# Altium schematic sheet Sht4-Interfaces.SchDoc
size C; SheetNumber: 4; SheetTotal: 4
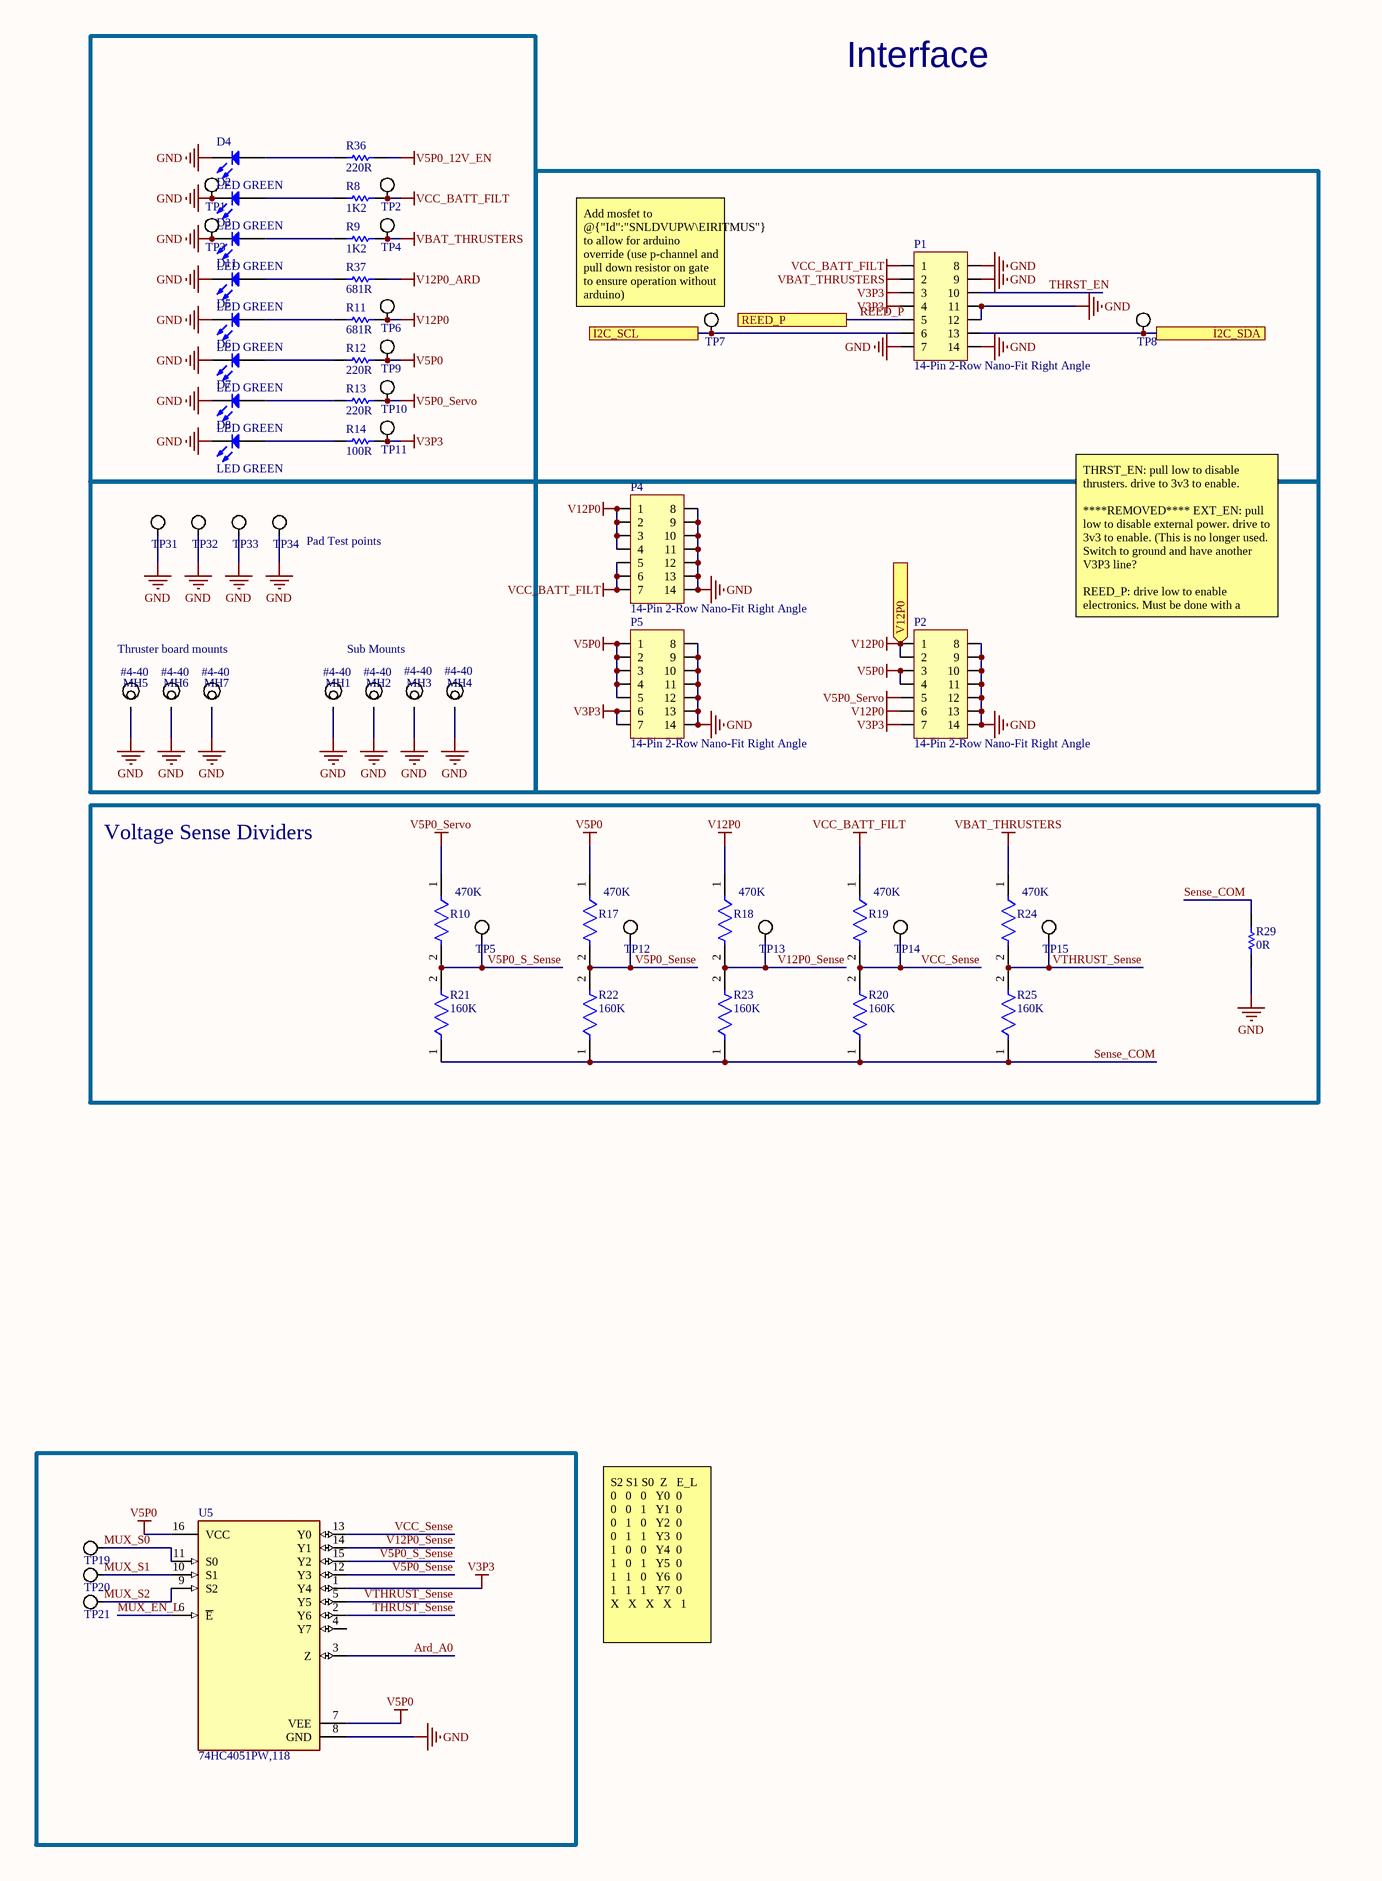
[diagram p0: Sht4-Interfaces.SchDoc, left]
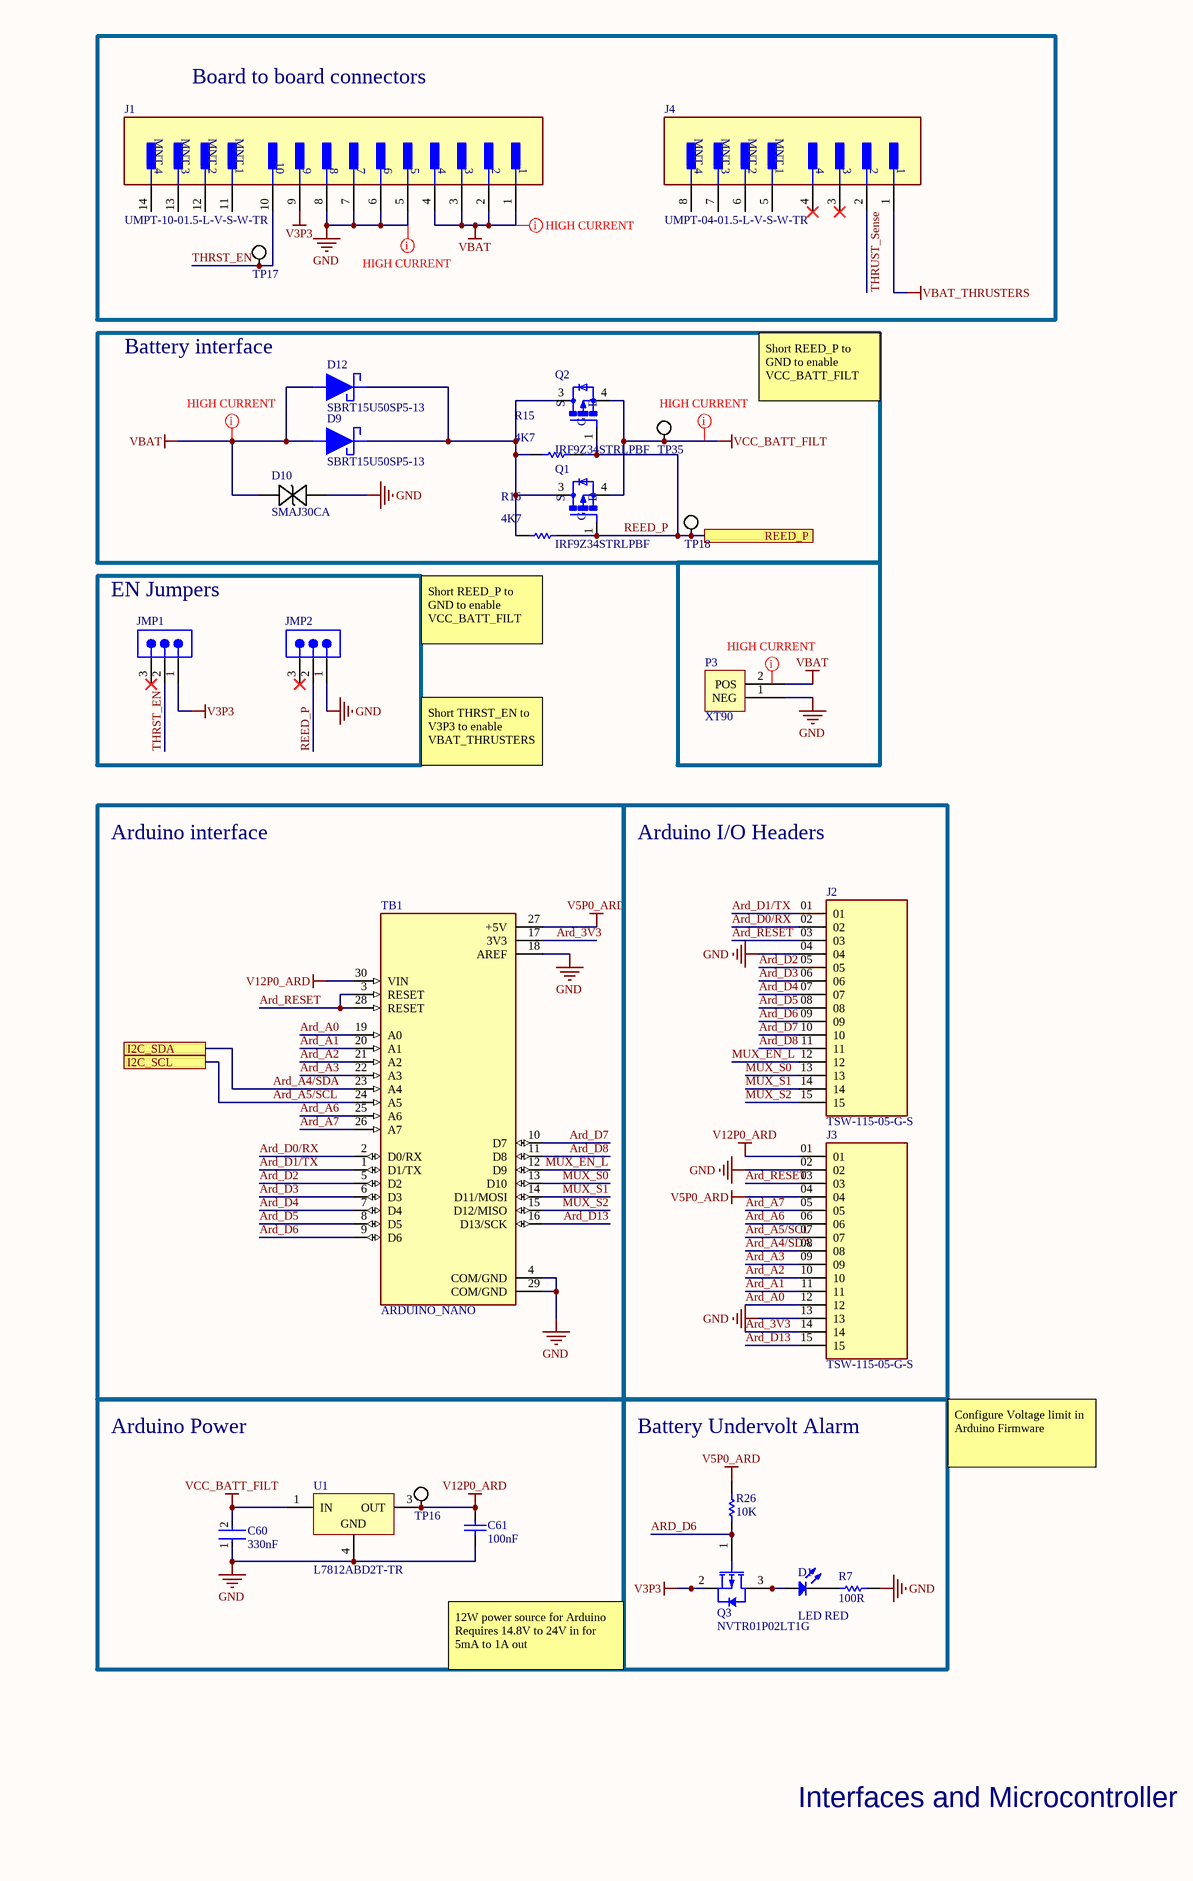
[diagram p1: Sht4-Interfaces.SchDoc, right]

## Parts
C60  330nF  [FP-C1608-080-0_1-IPC_A]
C61  100nF  [CAPC0603(1608)100_L]
D1  LED RED  [C0805]
D2  LED GREEN  [LED_0805]
D3  LED GREEN  [LED_0805]
D4  LED GREEN  [LED_0805]
D5  LED GREEN  [LED_0805]
D6  LED GREEN  [LED_0805]
D7  LED GREEN  [LED_0805]
D8  LED GREEN  [LED_0805]
D9  SBRT15U50SP5-13  [SBRT15U50SP5-13]
D10  SMAJ30CA  [SMASeries_LTF]
D11  LED GREEN  [LED_0805]
D12  SBRT15U50SP5-13  [SBRT15U50SP5-13]
J1  UMPT-10-01.5-L-V-S-W-TR  [FP-UMPT-10-01_5-L-V-S-W-T-MFG]
J2  TSW-115-05-G-S  [SAMTEC_TSW-115-05-G-S]
J3  TSW-115-05-G-S  [SAMTEC_TSW-115-05-G-S]
J4  UMPT-04-01.5-L-V-S-W-TR  [FP-UMPT-04-01_5-L-V-S-W-T-MFG]
JMP1  TSW-103-07-L-S  [SMTC-TSW-103-07-X-S]  (value not drawn)
JMP2  TSW-103-07-L-S  [SMTC-TSW-103-07-X-S]  (value not drawn)
MH1  #4-40  [Mounting Hole #4-40]
MH2  #4-40  [Mounting Hole #4-40]
MH3  #4-40  [Mounting Hole #4-40]
MH4  #4-40  [Mounting Hole #4-40]
MH5  #4-40  [Mounting Hole #4-40]
MH6  #4-40  [Mounting Hole #4-40]
MH7  #4-40  [Mounting Hole #4-40]
P1  14-Pin 2-Row Nano-Fit Right Angle  [MOLEX NANO-FIT 2X7 - Right Angle]
P2  14-Pin 2-Row Nano-Fit Right Angle  [MOLEX NANO-FIT 2X7 - Right Angle]
P3  XT90  [XT90]
P4  14-Pin 2-Row Nano-Fit Right Angle  [MOLEX NANO-FIT 2X7 - Right Angle]
P5  14-Pin 2-Row Nano-Fit Right Angle  [MOLEX NANO-FIT 2X7 - Right Angle]
Q1  IRF9Z34STRLPBF  [TO254P1521X483-4N]
Q2  IRF9Z34STRLPBF  [TO254P1521X483-4N]
Q3  NVTR01P02LT1G  [ONSC-SOT-23-3-318-08_V]
R7  100R  [RESC1609X50X30NL10T20]
R8  1K2  [RESC0603(1608)_L]
R9  1K2  [RESC0603(1608)_L]
R10  470K  [FP-CRCW0805-e3-IPC_C]
R11  681R  [RESC0603(1608)_L]
R12  220R  [RESC0603(1608)_L]
R13  220R  [RESC0603(1608)_L]
R14  100R  [RESC0603(1608)_L]
R15  4K7  [RESC0603(1608)_L]
R16  4K7  [RESC0603(1608)_L]
R17  470K  [FP-CRCW0805-e3-IPC_C]
R18  470K  [FP-CRCW0805-e3-IPC_C]
R19  470K  [FP-CRCW0805-e3-IPC_C]
R20  160K  [FP-CRCW0805-e3-IPC_C]
R21  160K  [FP-CRCW0805-e3-IPC_C]
R22  160K  [FP-CRCW0805-e3-IPC_C]
R23  160K  [FP-CRCW0805-e3-IPC_C]
R24  470K  [FP-CRCW0805-e3-IPC_C]
R25  160K  [FP-CRCW0805-e3-IPC_C]
R26  10K  [RESC1609X50X30NL8T20]
R29  0R  [RESC2013X50X30LL20T20]
R36  220R  [RESC0603(1608)_L]
R37  681R  [RESC0603(1608)_L]
TB1  ARDUINO_NANO  [SHIELD_ARDUINO_NANO]
TP1  Test Point Loop  [Test Point Loop - Black]  (value not drawn)
TP2  Test Point Loop  [Test Point Loop - Black]  (value not drawn)
TP3  Test Point Loop  [Test Point Loop - Black]  (value not drawn)
TP4  Test Point Loop  [Test Point Loop - Black]  (value not drawn)
TP5  (no value)  [Test Point Pad]
TP6  Test Point Loop  [Test Point Loop - Black]  (value not drawn)
TP7  Test Point Loop  [Test Point Loop - Black]  (value not drawn)
TP8  Test Point Loop  [Test Point Loop - Black]  (value not drawn)
TP9  Test Point Loop  [Test Point Loop - Black]  (value not drawn)
TP10  Test Point Loop  [Test Point Loop - Black]  (value not drawn)
TP11  Test Point Loop  [Test Point Loop - Black]  (value not drawn)
TP12  (no value)  [Test Point Pad]
TP13  (no value)  [Test Point Pad]
TP14  (no value)  [Test Point Pad]
TP15  (no value)  [Test Point Pad]
TP16  (no value)  [Test Point Pad]
TP17  (no value)  [Test Point Pad]
TP18  (no value)  [Test Point Pad]
TP19  (no value)  [Test Point Pad]
TP20  (no value)  [Test Point Pad]
TP21  (no value)  [Test Point Pad]
TP31  (no value)  [Test Point Pad]
TP32  (no value)  [Test Point Pad]
TP33  (no value)  [Test Point Pad]
TP34  (no value)  [Test Point Pad]
TP35  (no value)  [Test Point Pad]
U1  L7812ABD2T-TR  [TO-263_L]
U5  74HC4051PW,118  [FP-SOT403-1-IPC_A]

## Blocks framed on the sheet
Board to board connectors: J1 J4 TP17
Battery interface: D9 D10 D12 Q1 Q2 R15 R16 TP18 TP35
EN Jumpers: JMP1 JMP2
Voltage Sense Dividers: R10 R17-R25 R29 TP5 TP12-TP15
Arduino interface: TB1
Arduino I/O Headers: J2 J3
Arduino Power: C60 C61 TP16 U1
Battery Undervolt Alarm: D1 Q3 R7 R26

## Ports
I2C_SCL, I2C_SDA, REED_P, V12P0 (in, see Sht1-BlockDiagram[2B], Sht3-V12P0_reg[4B], Sht3-V12P0_reg[4C])

## Nets
GND: C60.1 C61.2 D2.1(K) D3.1(K) D4.1(K) D5.1(K) D6.1(K) D7.1(K) D8.1(K) D10.1 D11.1(K) J1.5 J1.6 J1.7 J1.8 J2.04 J3.02 J3.13 JMP2.1 MH1.0 MH2.0 MH3.0 MH4.0 MH5.0 MH6.0 MH7.0 P1.7 P1.8 P1.9 P1.11 P1.12 P1.14 P2.8 P2.9 P2.10 P2.11 P2.12 P2.13 P2.14 P3.1(NEG) P4.8 P4.9 P4.10 P4.11 P4.12 P4.13 P4.14 P5.8 P5.9 P5.10 P5.11 P5.12 P5.13 P5.14 R7.2 R29.2 TB1.4(COM/GND) TB1.18(AREF) TB1.29(COM/GND) TP1.1 TP3.1 TP31.1 TP32.1 TP33.1 TP34.1 U1.4(GND) U5.8(GND)
V3P3: J1.9 JMP1.1 P1.3 P1.4 P2.7 P5.6 P5.7 Q3.2(S) R14.2 TP11.1 U5.1(Y4)
V5P0: P2.3 P2.4 P5.1 P5.2 P5.3 P5.4 P5.5 R12.2 R17.1 TP9.1 U5.7(VEE) U5.16(VCC)
V5P0_12V_EN: R36.2
V5P0_ARD: J3.04 R26.2 TB1.27(+5V)
V5P0_Servo: P2.5 R10.1 R13.2 TP10.1
V12P0: P2.1 P2.2 P2.6 P4.1 P4.2 P4.3 P4.4 R11.2 R18.1 TP6.1 ; port V12P0
V12P0_ARD: C61.1 J3.01 R37.2 TB1.30(VIN) TP16.1 U1.3(OUT)
VBAT: D9.1 D10.2 D12.1 J1.1 J1.2 J1.3 J1.4 P3.2(POS)
VBAT_THRUSTERS: J4.1 P1.2 R9.2 R24.1 TP4.1
VCC_BATT_FILT: C60.2 P1.1 P4.5 P4.6 P4.7 Q1.4(D) Q2.4(D) R8.2 R19.1 TP2.1 TP35.1 U1.1(IN)
Ard_3V3: J3.14 TB1.17(3V3)
Ard_A0: J3.12 TB1.19(A0) U5.3(Z)
Ard_A1: J3.11 TB1.20(A1)
Ard_A2: J3.10 TB1.21(A2)
Ard_A3: J3.09 TB1.22(A3)
Ard_A4/SDA: J3.08 P1.13 TB1.23(A4) TP8.1 ; port I2C_SDA
Ard_A5/SCL: J3.07 P1.6 TB1.24(A5) TP7.1 ; port I2C_SCL
Ard_A6: J3.06 TB1.25(A6)
Ard_A7: J3.05 TB1.26(A7)
Ard_D0/RX: J2.02 TB1.2(D0/RX)
Ard_D1/TX: J2.01 TB1.1(D1/TX)
Ard_D2: J2.05 TB1.5(D2)
Ard_D3: J2.06 TB1.6(D3)
Ard_D4: J2.07 TB1.7(D4)
Ard_D5: J2.08 TB1.8(D5)
Ard_D6: J2.09 Q3.1(G) R26.1 TB1.9(D6)
Ard_D7: J2.10 TB1.10(D7)
Ard_D8: J2.11 TB1.11(D8)
Ard_D13: J3.15 TB1.16(D13/SCK)
Ard_RESET: J2.03 J3.03 TB1.3(RESET) TB1.28(RESET)
MUX_EN_L: J2.12 TB1.12(D9) U5.6(~{E})
MUX_S0: J2.13 TB1.13(D10) TP19.1 U5.11(S0)
MUX_S1: J2.14 TB1.14(D11/MOSI) TP20.1 U5.10(S1)
MUX_S2: J2.15 TB1.15(D12/MISO) TP21.1 U5.9(S2)
REED_P: JMP2.2 P1.5 Q1.1(G) Q2.1(G) R15.2 R16.2 TP18.1 ; port REED_P
Sense_COM: R20.1 R21.1 R22.1 R23.1 R25.1 R29.1
THRST_EN: J1.10 JMP1.2 P1.10 TP17.1
THRUST_Sense: J4.2 U5.2(Y6)
V5P0_S_Sense: R10.2 R21.2 TP5.1 U5.15(Y2)
V5P0_Sense: R17.2 R22.2 TP12.1 U5.12(Y3)
V12P0_Sense: R18.2 R23.2 TP13.1 U5.14(Y1)
VCC_Sense: R19.2 R20.2 TP14.1 U5.13(Y0)
VTHRUST_Sense: R24.2 R25.2 TP15.1 U5.5(Y5)
NetD1_1: D1.1(K) R7.1
NetD1_2: D1.2(A) Q3.3(D)
NetD2_2: D2.2(A) R8.1
NetD3_2: D3.2(A) R9.1
NetD4_2: D4.2(A) R36.1
NetD5_2: D5.2(A) R11.1
NetD6_2: D6.2(A) R12.1
NetD7_2: D7.2(A) R13.1
NetD8_2: D8.2(A) R14.1
NetD9_2: D9.2 D12.2 Q1.3(S) Q2.3(S) R15.1 R16.1
NetD11_2: D11.2(A) R37.1

Not connected (* = marked no-connect by the designer): J1 11(MNT_1) 12(MNT_2) 13(MNT_3) 14(MNT_4); J4 3* 4* 5(MNT_1) 6(MNT_2) 7(MNT_3) 8(MNT_4); JMP1 3*; JMP2 3*; U5 4(Y7)

## Layout directives
mark named HIGH CURRENT: (no net found under the mark), GND, VBAT, VCC_BATT_FILT

## Notes on the sheet
- Interface
- (near TP7) Add mosfet to @{"Id":"SNLDVUPW\EIRITMUS"} to allow for arduino override (use p-channel and pull down resistor on gate to ensure operation without arduino)
- Short REED_P to GND to enable VCC_BATT_FILT
- (near TP34) Pad Test points
- Thruster board mounts
- Sub Mounts
- THRST_EN: pull low to disable thrusters. drive to 3v3 to enable.
  ****REMOVED**** EXT_EN: pull low to disable external power. drive to 3v3 to enable. (This is no longer used. Switch to ground and have another V3P3 line?
  REED_P: drive low to enable electronics. Must be done with a hardware switch.
- Short THRST_EN to V3P3 to enable VBAT_THRUSTERS
- Configure Voltage limit in Arduino Firmware
- S2 S1 S0  Z   E_L
  0   0   0   Y0  0
  0   0   1   Y1  0
  0   1   0   Y2  0
  0   1   1   Y3  0
  1   0   0   Y4  0
  1   0   1   Y5  0
  1   1   0   Y6  0
  1   1   1   Y7  0
  X   X   X   X   1
- 12W power source for Arduino
  Requires 14.8V to 24V in for 5mA to 1A out
- Interfaces and Microcontroller

## Library data of the parts
C60 = 330nF 0603: Multilayer Ceramic Capacitors 330nF ±10% 50V X7R SMD 0603; Capacitance: 330nF; Case Code (Imperial): 0603; Case Code (Metric): 1608; Dielectric: X7R; Length: 1.6mm; Construction: Flat; Resistor Type: Ceramic; Mount: Surface Mount; Voltage Rating: 50V; Packaging: Tape and Reel; Series: C; Case/Package: 0603; Lead Free: Lead Free; Tolerance: 10%; Voltage: 50V; REACH SVHC: No SVHC; Height: 0.8mm; Weight: 7.1E-05oz; Termination: SMD/SMT; Max Operating Temperature: 125°C; RoHS Compliant: Yes; Min Operating Temperature: -55°C; Depth: 0.8mm; Package Quantity: 1; Thickness: 0.037inch; Voltage Rating (DC): 50V; Dielectric Material: Ceramic; Width: 0.031inch; ComponentLink1Description: Link; ComponentLink1URL: https://www.digikey.com/en/products/detail/tdk-corporation/C1608X7R1H334K080AC/2443428
C61 = 100nF 0603: CAP 100nF 100V ±10% 0603 (1608 Metric) Thickness 1mm SMD; Tolerance: Â±10%; Case-EIA: 0603; Case-Metric: 1608; Rated Voltage: 100 V; Value: 100nF; Technology: SMT; Max Thickness: 1 mm; ComponentLink1Description: Link; ComponentLink1URL: https://www.digikey.com/en/products/detail/samsung-electro-mechanics/CL10B104KC8NNNC/5961291
D1 = Red LED 0805: led / LTST-C171KRKT; Manufacturer: Lite-On Inc.; Lens Color: Colorless; Lens Transparency: Clear; Millicandela Rating: 54mcd; Lens Style/Size: Rectangle with Flat Top, 1.40mm x 1.25mm; Voltage - Forward (Vf) (Typ): 2V; Current - Test: 20mA; Viewing Angle: 130°; Wavelength - Dominant: 631nm; Wavelength - Peak: 639nm; Supplier 1: Digi-Key; Supplier Part Number 1: 160-1427-1-ND; Manufacturer Part Number: LTST-C171KRKT; RoHS: RoHS Compliant; Category: Optoelectronics; Stock 1: 260544; Pricing 1: 1=0.31, 10=0.225, 25=0.1656, 100=0.1183, 250=0.0804, 500=0.07096, 1000=0.05558 (USD); Packaging: Cut Tape (CT); Part Status: Active; Color: Red; Mounting Type: Surface Mount; Features: -; Package / Case: 0805 (2012 Metric); Size / Dimension: 2.00mm L x 1.25mm W; Height (Max): 0.80mm; ComponentLink1URL: http://optoelectronics.liteon.com/upload/download/DS22-2000-109/LTST-C171KRKT.pdf; ComponentLink1Description: http://optoelectronics.liteon.com/upload/download/DS22-2000-109/LTST-C171KRKT.pdf; ComponentLink2Description: Link; ComponentLink2URL: https://www.digikey.com/en/products/detail/liteon/LTST-C171KRKT/386801
D2-D8 D11 = Green LED 0805: led; Manufacturer: Lite-On Inc.; Manufacturer Part Number: LTST-C171KGKT; Lens Color: Colorless; Lens Transparency: Clear; Millicandela Rating: 35mcd; Lens Style/Size: Rectangle with Flat Top, 1.40mm x 1.25mm; Voltage - Forward (Vf) (Typ): 2V; Current - Test: 20mA; Viewing Angle: 130°; Wavelength - Dominant: 571nm; Wavelength - Peak: 574nm; Supplier 1: Digi-Key; Supplier Part Number 1: 160-1426-1-ND; RoHS: RoHS Compliant; Category: Optoelectronics; Stock 1: 350441; Pricing 1: 1=0.31, 10=0.225, 25=0.1656, 100=0.1183, 250=0.0804, 500=0.07096, 1000=0.05558 (USD); Packaging: Cut Tape (CT); Part Status: Active; Color: Green; Mounting Type: Surface Mount; Features: -; Package / Case: 0805 (2012 Metric); Size / Dimension: 2.00mm L x 1.25mm W; Height (Max): 0.90mm; ComponentLink1URL: http://optoelectronics.liteon.com/upload/download/DS22-2000-118/LTST-C171KGKT.pdf; ComponentLink1Description: http://optoelectronics.liteon.com/upload/download/DS22-2000-118/LTST-C171KGKT.pdf; ComponentLink2Description: Link; ComponentLink2URL: https://www.digikey.com/en/products/detail/LTST-C171KGKT/160-1426-1-ND/386798?curr=usd&utm_campaign=buynow&utm_medium=aggregator&utm_source=octopart
D10 = SMAJ30CA: No Description Available; Mfr_Name: Littelfuse Inc; Digi-Key_Part_Number_8: SMAJ30CALFTR-ND; Digi-Key_Part_Number_7: SMAJ30CALFDKR-ND; Digi-Key_Part_Number_1: 2516-SMAJ30CATR-ND; Digi-Key_Part_Number_2: 2997-SMAJ30CATR-ND; Digi-Key_Part_Number_3: SMAJ30CABCT-ND; Digi-Key_Part_Number_4: SMAJ30CABDKR-ND; Digi-Key_Part_Number_5: SMAJ30CABTR-ND; Digi-Key_Part_Number_6: SMAJ30CALFCT-ND
J1 = UMPT-10-1.5: CONN MPOWER 2MM MALE 10POS GOLD; System: Connector; ComponentLink1Description: Link; ComponentLink1URL: https://www.digikey.com/en/products/detail/samtec-inc/UMPT-10-01-5-L-V-S-W-TR/14670365?s=N4IgTCBcDaIKoFkAKAVAtARgAxqxgdAKxoAyaAamgMpoDqaKASiALoC%2BQA
J2 J3 = TSW-115-05-G-S: MF: Samtec; Value: *; Availability: Unavailable; Price: None; MP: TSW-115-05-G-S; Package: None
J4 = UMPT-04-1.5: CONN MPOWER 2MM MALE 4POS GOLD; ComponentLink1Description: Link; ComponentLink1URL: https://www.digikey.com/en/products/detail/samtec-inc/UMPT-04-01-5-L-V-S-W-TR/14670336?s=N4IgTCBcDaIKoFkAKAVAtABgCyYIwDoBWNAGTQDU0BlNAdTRQCUQBdAXyA
JMP1 JMP2 = 3 Pos .1" connector/jumper: 0.025" SQ Post Header, Through-hole, Vertical, -55 to 125 degC, 2.54 mm Pitch, 3-Pin, Male, RoHS; Manufacturer: Samtec; Pitch: 2.54 mm; Mounting Technology: Through-hole; ComponentLink2URL: http://www.samtec.com/documents/webfiles/pdf/TSW_TH.PDF; ComponentLink3Description: Package Specification; PackageVersion: DM, 8/1988; PartNumber: TSW-103-07-L-S; PackageReference: TSW-103-07-X-S; Orientation: Vertical; ComponentLink1URL: http://www.samtec.com; PackageDescription: .025[0.64] SQ. Post Terminal Strip Assembly; ComponentLink1Description: Manufacturer URL; ComponentLink2Description: Datasheet; ComponentLink3URL: http://www.samtec.com/documents/webfiles/cpdf/TSW-XXX-XX-XXX-X-XX-XXX-MKT.pdf; RoHS: True; DatasheetVersion: F-214; Temperature Range: -55 to 125 degC
MH1-MH7 = Mounting Hole #4-40, Loose Fit: Mounting Hole for ANSI #4-40 w/ Flat Washer, Loose Fit; Datasheet: http://blogs.mentor.com/tom-hausherr/blog/tag/pcb-mounting-holes/
P1 P2 P4 P5 = 14-Pin 2-Row Nano-Fit Right Angle: NanoFit Right Hdr TH DR 14Ckt; Part Number: 105314-1214; Manufacturer: Molex; Supplier: Mouser; Supplier Part Number: 538-105314-1214; Supplier 1: Mouser; Supplier Part Number 1: 538-105314-1214; ComponentLink1Description: Mouser Link; ComponentLink1URL: https://www.mouser.com/ProductDetail/Molex/105314-1214?qs=PqFvFmEiOr6wLIXpvlvqbA%3D%3D; ComponentLink2Description: Link; ComponentLink2URL: https://www.digikey.com/en/products/detail/molex/1053141114/7693193
Q1 Q2 = IRF9Z34STRLPBF: P-Channel 60V 18A _Tc_ 3.7W _Ta_, 88W _Tc_ Surface Mount D2PAK; MF: Vishay; Package: D2PAK Vishay; Value: *; Availability: Unavailable; MP: IRF9Z34STRLPBF; Price: None; SnapEDA_Link: https://www.snapeda.com/parts/IRF9Z34STRLPBF/Vishay%20Siliconix/view-part/813693/?ref=snap
Q3 = PMOS SOT-23: Power MOSFET, -20 V, -1.3 A, P-Channel, 3-Pin SOT-23, Pb-Free, Tape and Reel; Manufacturer: On Semiconductor; Ciss Typ (pF): 225; Configuration: Single; Coss Typ (pF): 130; PD Max (W): 0.4; ID Max (A): 1.3; Crss Typ (pF): 55; VGS Max (V): 12; V(BR)DSS Min (V): 20; VGS(th) Max (V): 1.25; Qrr Typ (nC): 8.5; Channel Polarity: P Channel; ComponentLink1URL: http://www.onsemi.com/; PackageReference: SOT-23-3-318-08; RoHS: Pb-Free; ComponentLink1Description: Manufacturer URL; PackageDescription: 3-Pin Small Outline Transistor, Body 2.92 x 1.3 mm, Pitch 0.95 mm; ComponentLink3Description: Package Specification; ComponentLink2Description: Datasheet; Package Type: SOT-23-3; ComponentLink2URL: http://www.onsemi.cn/pub_link/Collateral/NTR1P02LT1-D.PDF; Packing: Tape and Reel; Mounting Technology: Surface Mount; ComponentLink3URL: http://www.onsemi.cn/pub_link/Collateral/318-08.PDF; PartNumber: NVTR01P02LT1G; PackageVersion: Rev. AP, 11/2009; DatasheetVersion: Rev. 13; ComponentLink4Description: Link; ComponentLink4URL: https://www.digikey.com/en/products/detail/vishay-siliconix/IRF9Z34STRLPBF/856689?s=N4IgTCBcDaIJICUBiBOAWgZgCwGUAqCAMgAoBCSIAugL5A
R7 = 100R 0603: 100R 0.1W 5%; Part Number: CRCW0603100RJNTA; Manufacturer: Vishay Dale; ComponentLink1Description: Link; ComponentLink1URL: https://www.digikey.com/en/products/detail/yageo/RC0603FR-13100RL/12756392
R8 R9 = CMP-1012-00518-1: 1K2 0.1W 1% 0603 (1608 Metric)  SMD; Case-EIA: 0603; Value: 1200.00 Ohm; Case-Metric: 1608; Power: 0.1 W; Technology: SMT; Tolerance: 1 %
R10 R17-R19 R24 = 470K 0805: RES Thick Film, 470kΩ, 1%, 0.125W, 100ppm/°C, 0805; Power Rating: 125mW; Voltage Rating (DC): 150V; Depth: 1.25mm; Voltage Rating: 150V; Composition: Thick Film; Temperature Coefficient: 100ppm/°C; Max Operating Temperature: 155°C; Min Operating Temperature: -55°C; Package Quantity: 10; Width: 0.049inch; Number of Pins: 2; Length: 2mm; Case Code (Metric): 2012; Weight: 0.000194oz; Features: Automotive AEC-Q200; Number of Terminations: 2; Radiation Hardening: No; Height: 0.45mm; Military Standard: Not; Tolerance: 1%; Lead Free: Lead Free; Termination: SMD/SMT; Case Code (Imperial): 0805; Case/Package: 0805; Contact Plating: Tin; Packaging: Tape and Reel; Max Power Dissipation: 125mW; ComponentLink1Description: Link; ComponentLink1URL: https://www.digikey.com/en/products/detail/yageo/RC0805FR-07470KL/727977
R11 R37 = CMP-1012-00492-1: 681R 0.1W 1% 0603 (1608 Metric)  SMD; Value: 681.00 Ohm; Case-Metric: 1608; Case-EIA: 0603; Technology: SMT; Tolerance: 1 %; Power: 0.1 W
R12 R13 R36 = CMP-1012-00058-1: 220R 0.1W 5% 0603 (1608 Metric)  SMD; Case-EIA: 0603; Case-Metric: 1608; Value: 220.00 Ohm; Technology: SMT; Power: 0.1 W; Tolerance: 5 %
R14 = CMP-1012-00050-1: 100R 0.1W 5% 0603 (1608 Metric)  SMD; Case-EIA: 0603; Value: 100.00 Ohm; Case-Metric: 1608; Tolerance: 5 %; Technology: SMT; Power: 0.1 W
R15 R16 = 4K7 0603: 4K7 0.1W 1% 0603 (1608 Metric)  SMD; Case-EIA: 0603; Case-Metric: 1608; Value: 4700.00 Ohm; Power: 0.1 W; Tolerance: 1 %; Technology: SMT; ComponentLink1Description: Link; ComponentLink1URL: https://www.digikey.com/en/products/detail/yageo/RC0603FR-074K7L/727212
R20-R23 R25 = 160K 0805: RES Thick Film, 160kΩ, 1%, 0.125W, 100ppm/°C, 0805; Voltage Rating: 150V; Power Rating: 125mW; Width: 1.25mm; Case/Package: 0805; Package Quantity: 5000; Temperature Coefficient: 100ppm/°C; Length: 2mm; Height: 0.45mm; Weight: 0.000194oz; Mount: Surface Mount; Case Code (Metric): 2012; Min Operating Temperature: -55°C; Termination: SMD/SMT; Case Code (Imperial): 0805; Number of Pins: 2; Packaging: Tape and Reel; Max Operating Temperature: 155°C; Radiation Hardening: No; Military Standard: Not; Depth: 1.25mm; Tolerance: 1%; Composition: Thick Film; Contact Plating: Tin; ComponentLink1Description: Link; ComponentLink1URL: https://www.digikey.com/en/products/detail/yageo/RC0805FR-07160KL/727628
R26 = 10K 0603: Chip Resistor, 10 KOhm, +/- 1%, 100 mW, -55 to 155 degC, 0603 (1608 Metric), RoHS, Tape and Reel; Manufacturer: Vishay Semiconductor; Voltage Rating: 75 V; Max Operating Temperature: 155 degC; PackageDescription: 2-Pin Surface Mount Device, Body 1.575 x 0.85 mm; ComponentLink1Description: Manufacturer URL; RoHSCompliant: true; PackageReference: 0603; REACH SVHC: Unknown; Length: 1.55 mm; DatasheetVersion: 06/2012; Packaging: Tape and Reel; Min Operating Temperature: -55 degC; Mounting Technology: Surface Mount; ComponentLink2URL: https://datasheet.ciiva.com/11809/0900766b80d98afc-11809037.pdf; Height: 0.45 mm; ComponentLink2Description: Datasheet; Package Quantity: 5000; ComponentLink1URL: http://www.vishay.com/; ComponentLink3Description: Link; ComponentLink3URL: https://www.digikey.com/en/products/detail/stackpole-electronics-inc/RNCP0603FTD10K0/2240139
R29 = 0R 0805: 0 Ohm 0805; Manufacturer: Vishay Dale; Part Number: CRCW08050000Z0EA; ComponentLink1Description: Link; ComponentLink1URL: https://www.digikey.com/en/products/detail/stackpole-electronics-inc/RMCF0805ZT0R00/1756901
TB1 = ARDUINO_NANO: Small, complete, and breadboard-friendly board based on the ATmega328 (Arduino Nano 3.x); Check_prices: https://www.snapeda.com/parts/Arduino%20Nano/Arduino/view-part/?ref=eda; Value: *; Availability: Not in stock; MP: Arduino Nano; Price: None; Package: Non-Standard Arduino; SnapEDA_Link: https://www.snapeda.com/parts/Arduino%20Nano/Arduino/view-part/?ref=snap; MF: Arduino
TP1-TP4 TP6-TP11 = Test Point Loop: Keyston Electronics 5001 Test Point Loop; Manufacturer P/N: 5001; Manufacturer: Keystone Electronics; Color: Black; Supplier 1: Digi-Key; Supplier Part Number 1: 36-5001-ND
TP5 TP12-TP21 TP31-TP35 = Test Point Pad: Test point, Pad, 28 mil
U1 = L7812ABD2T-TR: Positive Voltage Regulator, 3-Pin D2PAK, Tape and Reel; ComponentLink1Description: Manufacturer URL; ComponentLink2URL: http://www.st.com/internet/com/TECHNICAL_RESOURCES/TECHNICAL_LITERATURE/DATASHEET/CD00000444.pdf; PackageVersion: 2011; PackageDescription: 3-Pin Transistor Outline Package 2.54 mm Pitch, 15.4 mm Lead Span (D2PAK); DatasheetVersion: 16/11/2011; PackageReference: TO-263; ComponentLink1URL: http://www.st.com; ComponentLink2Description: Datasheet; ComponentLink3Description: Link; ComponentLink3URL: https://www.digikey.com/en/products/detail/stmicroelectronics/L7812ABD2T-TR/1038261?s=N4IgTCBcDaIDIHYAcBGMBBAQgETAFQFo8AlEAXQF8g
U5 = 74HC4051PW,118: IC MUX/DEMUX 8X1 16TSSOP; RoHS Compliant: Yes; ComponentLink1Description: Link; ComponentLink1URL: https://www.digikey.com/en/products/detail/nexperia-usa-inc/74HC4051PW-118/946649
D9 D12 = SBRT15U50SP5-13: Supplier 1: Digi-Key; Supplier Part Number 1: SBRT15U50SP5-13DICT-ND